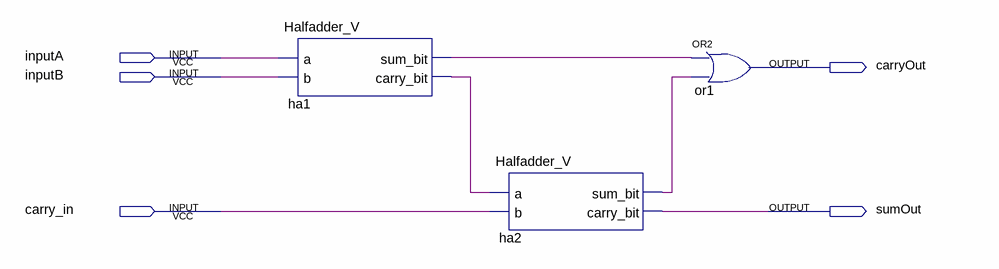
[diagram p0: schematic sheet]
// Quartus schematic full_adder.bdf as structural Verilog: 3 symbols, 5 pins
module full_adder (
  input  inputA,
  input  inputB,
  input  carry_in,
  output carryOut,
  output sumOut
);

  wire ha1_carry_bit, ha1_sum_bit, ha2_sum_bit;

  Halfadder_V ha1 (.a(inputA), .b(inputB), .sum_bit(ha1_sum_bit), .carry_bit(ha1_carry_bit));
  Halfadder_V ha2 (.a(ha1_carry_bit), .b(carry_in), .sum_bit(ha2_sum_bit), .carry_bit(sumOut));
  or or1 (carryOut, ha1_sum_bit, ha2_sum_bit);
endmodule
